# Altium schematic sheet Sheet1.SchDoc
size A4; SheetNumber: 2; SheetTotal: 2; SPICEModelCacheVPMOZYLU: <root> / <DocumentId>VPMOZYLU</DocumentId> / <CacheFrame Number="0"> / <Model Name="diode" Kind="MDL"> / <Text>*Default Diode / *Diode Pinout: A,K / .MODEL DIODE D()</Text> / </Model> / </CacheFrame> / </root>
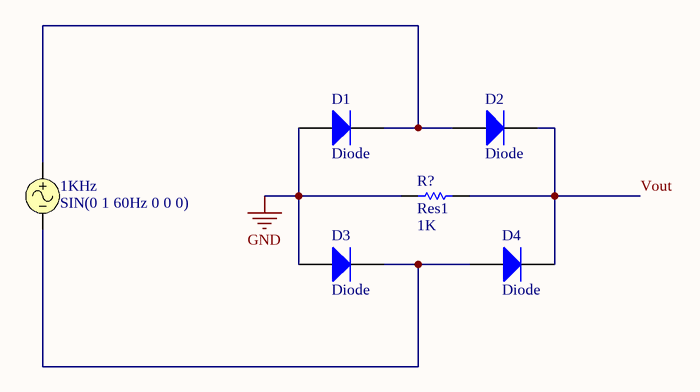
[diagram p0: Sheet1.SchDoc]

## Parts
1KHz  SIN(0 1 60Hz 0 0 0)
D1  Diode  [SMC]
D2  Diode  [SMC]
D3  Diode  [SMC]
D4  Diode  [SMC]
R?  Res1  value 1K  [AXIAL-0.3]

## Nets
GND: D1.1(A) D3.1(A) R?.1
Vout: D2.2(K) D4.2(K) R?.2
Net1KHz_1: 1KHz.1 D1.2(K) D2.1(A)
Net1KHz_2: 1KHz.2 D3.2(K) D4.1(A)

## Library data of the parts
1KHz = VSIN: Sinusoidal Voltage Source; Note: PCB Footprint - Not required; Offset: 0; Amplitude: 1; Published: 8-Jun-2000; LatestRevisionDate: 15-Nov-2004; LatestRevisionNote: Corrected Netlist.; PackageReference: Not Applicable; Publisher: Altium Limited; Frequency: 60Hz; Delay: 0; Damping Factor: 0; Phase: 0; DC Magnitude: 0; AC Magnitude: 1; AC Phase: 0
D1-D4 = Diode: Default Diode; Published: 8-Jun-2000; LatestRevisionDate: 17-Jul-2002; LatestRevisionNote: Re-released for DXP Platform.; PackageVersion: Sep-1996; PackageReference: SMC; Publisher: Altium Limited; PackageDescription: DO-214-AB/SMC; 2 C-Bend Leads; Body 7.9 x 5.9 mm, inc. leads (LxW); Code_JEDEC: DO-214-AB
R? = Res1: Resistor; Published: 8-Jun-2000; LatestRevisionDate: 17-Jul-2002; LatestRevisionNote: Re-released for DXP Platform.; PackageReference: AXIAL-0.3; Publisher: Altium Limited; PackageDescription: Axial Device, Thru-Hole; 2 Leads; 0.3 in Pin Spacing